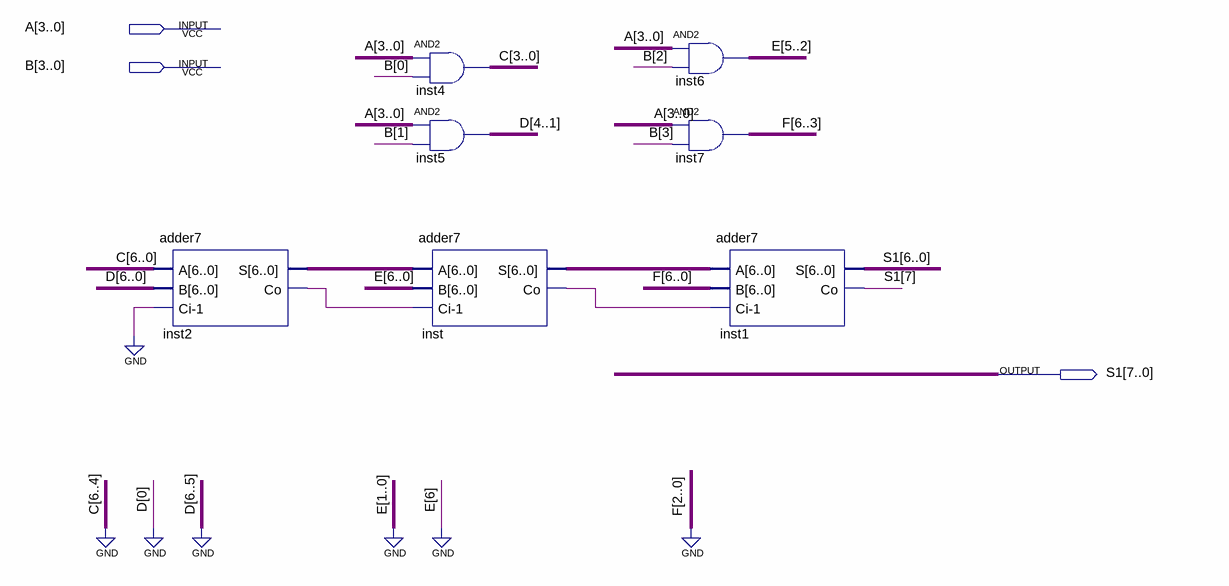
[diagram p0: schematic sheet]
// Quartus schematic MUL.bdf as structural Verilog: 7 symbols, 3 pins
module MUL (
  input  [3:0] A,
  input  [3:0] B,
  output [7:0] S1
);

  wire inst2_co, inst_co;
  wire [3:0] C;
  wire [4:1] D;
  wire [5:2] E;
  wire [6:0] inst2_s, inst_s;
  wire [6:3] F;

  adder7 inst2 (.A({3'b000, C}), .B({2'b00, D, 1'b0}), .\Ci-1 (1'b0), .S(inst2_s), .Co(inst2_co));
  assign C = A & {4{B[0]}};  // AND2 inst4, 4 bits wide
  assign D = A & {4{B[1]}};  // AND2 inst5, 4 bits wide
  adder7 inst (.A(inst2_s), .B({1'b0, E, 2'b00}), .\Ci-1 (inst2_co), .S(inst_s), .Co(inst_co));
  assign E = A & {4{B[2]}};  // AND2 inst6, 4 bits wide
  assign F = A & {4{B[3]}};  // AND2 inst7, 4 bits wide
  adder7 inst1 (.A(inst_s), .B({F, 3'b000}), .\Ci-1 (inst_co), .S(S1[6:0]), .Co(S1[7]));
endmodule
